# Altium project Sayma_RTM.PrjPcb (part 8 of 11)

## Sheet RTM_IPMI.SchDoc: Sayma RTM
size 420 x 297 mm; $$Internal___BlkDate: 23:43:25_12-13-18; $$Internal_NAME_PLACEHOLDER: a3sheet; $$Internal_Resolution: 00001mm; $$NotCommonProperty_@NAME: RTM_IPMI; $$NotCommonProperty_@PRINTORDER: 15; $$NotCommonProperty_@SHEET: 1; $$NotCommonProperty_@SHEETTOTAL: 16; CmpIndex: 4; Drawing Author: G.Kasprowicz; Drawing Number: Sayma RTM; Drawing Project: 8 channel SAWG; Drawing Revision: 2.0; SymIndex: 2227; Author: G.Kasprowicz; CompanyName: WUT ISE; DrawnBy: G.Kasprowicz; Organization: WUT ISE; Address1: PW ISE; Address2: Nowowiejska 15/19 00-665 Warsaw; Address3: gkasprow@gmail.com; DocumentNumber: 17; Revision: 1.0; SheetNumber: 17; SheetTotal: 18; ModifiedBy: -; CheckedDate: -; Title2: RTM IPMI; DivGrp: WUT ISE; Designer: G.Kasprowicz; ModifiedDate: -; ProjectName: Sensor Box
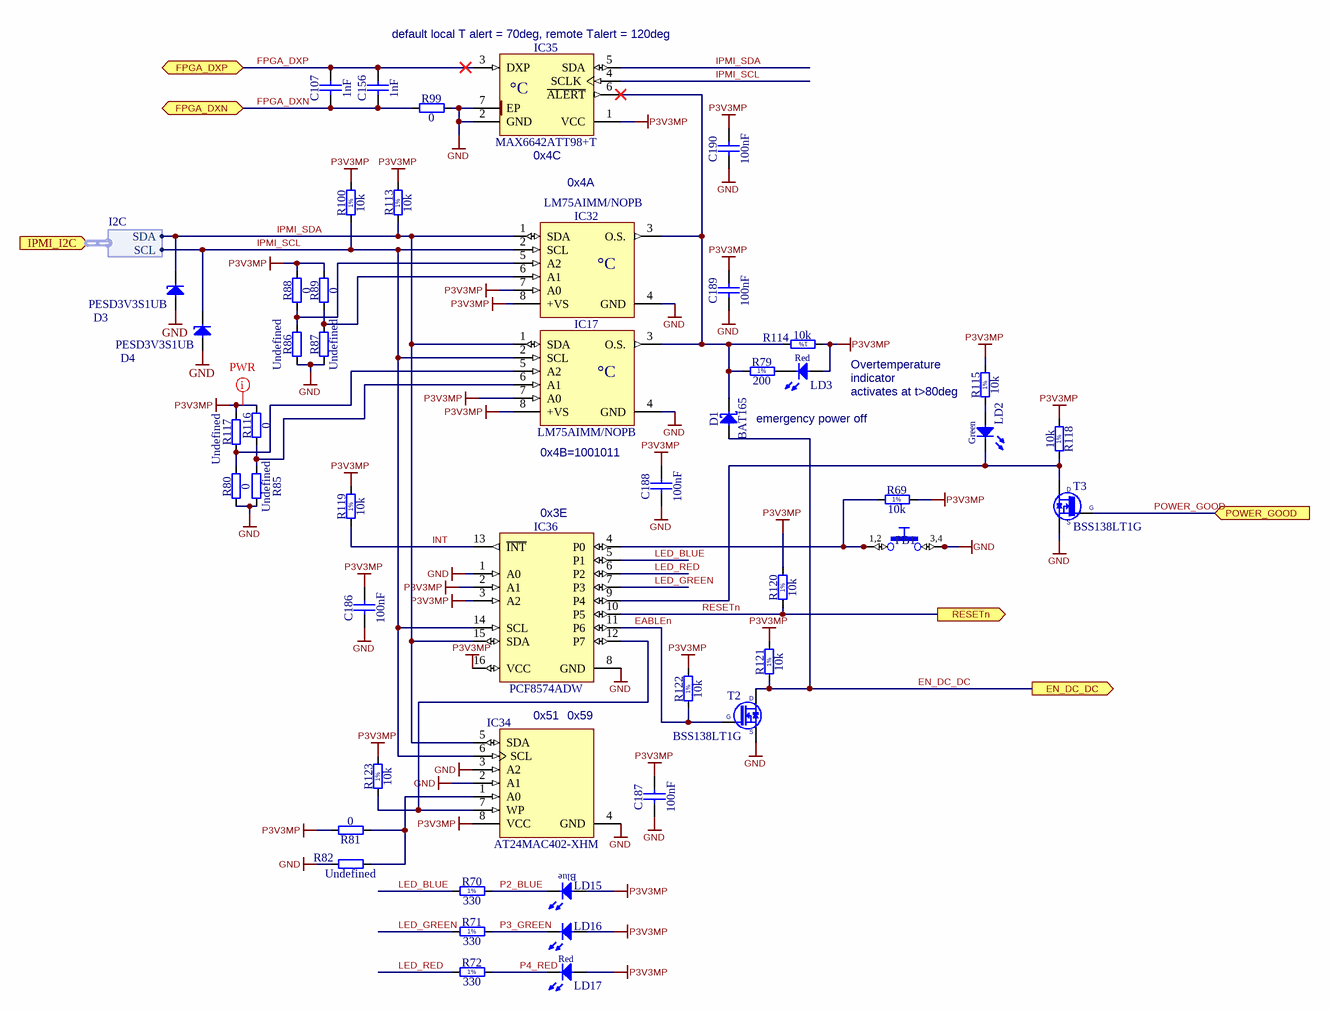
[diagram p11: RTM_IPMI.SchDoc]

### Parts
C107  1nF  [CAPC1005X55N]
C156  1nF  [CAPC1005X55N]
C186  100nF  [CAPC0603X33N]
C187  100nF  [CAPC0603X33N]
C188  100nF  [CAPC0603X33N]
C189  100nF  [CAPC0603X33N]
C190  100nF  [CAPC0603X33N]
D1  BAT165  [SOD2512X110N]
D3  PESD3V3S1UB  [SODFL1608X65N]
D4  PESD3V3S1UB  [SODFL1608X65N]
IC17  LM75AIMM/NOPB  [SOP65P490X109-8N]
IC32  LM75AIMM/NOPB  [SOP65P490X109-8N]
IC34  AT24MAC402-XHM  [SOP65P640X120-8N]
IC35  MAX6642ATT98+T  [SON95P300X300X80-7N-R160X240]
IC36  PCF8574ADW  [SOIC127P1030X265-16N]
LD2  Green  [LED_KINGBRIGHT_KPH-1608CGCK]
LD3  Red  [LED_KINGBRIGHT_KPH-1608SURCK]
LD15  Blue  [LED_AVAGO_HSMR-C120]  (value not drawn)
LD16  Green  [LED_AVAGO_HSME-C120]  (value not drawn)
LD17  Red  [LED_KINGBRIGHT_KPH-1608SURCK]
PB1  Push Button  [SW_C&K_HDT0001]  (value not drawn)
R69  10k  [RESC1005X40N]
R70  330  [RESC1005X40N]
R71  330  [RESC1005X40N]
R72  330  [RESC1005X40N]
R79  200  [RESC1005X40N]
R80  0  [RESC1005X40N]
R81  0  [RESC1005X40N]
R82  Undefined  [RESC1005X40N]
R85  Undefined  [RESC1005X40N]
R86  Undefined  [RESC1005X40N]
R87  Undefined  [RESC1005X40N]
R88  0  [RESC1005X40N]
R89  0  [RESC1005X40N]
R99  0  [RESC1005X40N]
R100  10k  [RESC1005X40N]
R113  10k  [RESC1005X40N]
R114  10k  [RESC1005X40N]
R115  10k  [RESC1005X40N]
R116  0  [RESC1005X40N]
R117  Undefined  [RESC1005X40N]
R118  10k  [RESC1005X40N]
R119  10k  [RESC1005X40N]
R120  10k  [RESC1005X40N]
R121  10k  [RESC1005X40N]
R122  10k  [RESC1005X40N]
R123  10k  [RESC1005X40N]
T2  BSS138LT1G  [SOT95P240X110-3N]
T3  BSS138LT1G  [SOT95P240X110-3N]

### Ports
EN_DC_DC (out), FPGA_DXN (bidir), FPGA_DXP (bidir), IPMI_I2C (in, harness I2C), POWER_GOOD (in), RESETn (out)

### Harnesses
I2C: SCL, SDA

### Nets
GND: C186.1 C187.1 C188.1 C189.1 C190.1 D3.2(A) D4.2(A) IC17.4(GND) IC32.4(GND) IC34.2(A1) IC34.3(A2) IC34.4(GND) IC35.2(GND) IC35.7(EP) IC36.1(A0) IC36.8(GND) PB1.3 PB1.4 R80.1 R82.1 R85.1 R86.1 R87.1 R99.2 T2.2(S) T3.2(S)
P3V3MP: C186.2 C187.2 C188.2 C189.2 C190.2 IC17.7(A0) IC17.8(+VS) IC32.7(A0) IC32.8(+VS) IC34.8(VCC) IC35.1(VCC) IC36.2(A1) IC36.3(A2) IC36.16(VCC) LD3.2(A) LD15.2(A) LD16.2(A) LD17.2(A) R69.2 R81.2 R88.2 R89.2 R100.2 R113.2 R114.1 R115.2 R116.2 R117.2 R118.2 R119.2 R120.2 R121.2 R122.2 R123.2
EABLEn: IC36.11(P6) R122.1 T2.1(G)
EN_DC_DC: D1.2(A) R121.1 T2.3(D) ; port EN_DC_DC  [project net EN]
FPGA_DXN: C107.1 C156.1 R99.1 ; port FPGA_DXN
FPGA_DXP: C107.2 C156.2 IC35.3(DXP) ; port FPGA_DXP
INT: IC36.13(~{INT}) R119.1
IPMI_SCL: D4.1(C) IC17.2(SCL) IC32.2(SCL) IC34.6(SCL) IC35.4(SCLK) IC36.14(SCL) R100.1 ; port IPMI_I2C.SCL  [project net IPMI_I2C.SCL]
IPMI_SDA: D3.1(C) IC17.1(SDA) IC32.1(SDA) IC34.5(SDA) IC35.5(SDA) IC36.15(SDA) R113.1 ; port IPMI_I2C.SDA  [project net IPMI_I2C.SDA]
LED_BLUE: IC36.5(P1) R70.1
LED_GREEN: IC36.7(P3) R71.1
LED_RED: IC36.6(P2) R72.1
P2_BLUE: LD15.1(C) R70.2
P3_GREEN: LD16.1(C) R71.2
P4_RED: LD17.1(C) R72.2
POWER_GOOD: T3.1(G) ; port POWER_GOOD  [project net PGOOD]
RESETn: IC36.10(P5) R120.1 ; port RESETn
NetD1_1: D1.1(C) IC17.3(O.S.) IC32.3(O.S.) IC35.6(~{ALERT}) R79.1 R114.2
NetIC17_5: IC17.5(A2) R80.2 R117.1
NetIC17_6: IC17.6(A1) R85.2 R116.1
NetIC32_5: IC32.5(A2) R86.2 R88.1
NetIC32_6: IC32.6(A1) R87.2 R89.1
NetIC34_1: IC34.1(A0) R81.1 R82.2
NetIC34_7: IC34.7(WP) IC36.12(P7) R123.1
NetIC36_4: IC36.4(P0) PB1.1 PB1.2 R69.1
NetIC36_9: IC36.9(P4) LD2.1(C) R118.1 T3.3(D)
NetLD2_2: LD2.2(A) R115.1
NetLD3_1: LD3.1(C) R79.2

### Layout directives
net class PWR: P3V3MP

### Notes on the sheet
- default local T alert = 70deg, remote Talert = 120deg
- (near IC35) 0x4C
- 0x4A
- Overtemperature
- indicator
- 0x4B=1001011
- emergency power off
- (near R115) activates at t>80deg
- (near IC36) 0x3E
- (near IC34) 0x51
- (near IC34) 0x59
- Project/Equipment
- Document
- Designer
- Drawn by
- Check.by
- Copyright WUT ISE 2018.
  This documentation describes Open Hardware and is licensed under the CERN OHL v.1.1. You may redistribute and modify this documentation under the terms of the CERN OHL v.1.1. (http://ohwr.org/CERNOHL). This documentation is distributed WITHOUT ANY EXPRESS OR IMPLIED WARRANTY, INCLUDING OF MERCHANTABILITY, SATISFACTORY QUALITY AND FITNESS FOR A PARTICULAR PURPOSE. Please see the CERN OHL v.1.1 for applicable conditions.
- Contact
- File
- Last Mod.
- Print Date
- Sheet
- Size
- A3
- of
- Rev
- (in symbol LM75AIMM/NOPB) °C
- (in symbol MAX6642ATT98+T) °C
- (in symbol R0402_10K_1%_0.0625W_100PPM) 1%
- (in symbol R0402_200R_1%_0.0625W_100PPM) 1%
- (in symbol R0402_330R_1%_0.0625W_100PPM) 1%
- (in symbol SW_C&K_HDT0001) 1,2; 3,4

### Library data of the parts
C107 C156 = CC0402_1NF_50V_10%_X7R: Non-polarised capacitor; Manufacturer: GENERIC; Part Description: SMD Multilayer Chip Ceramic Capacitor; Manufacturer1 Part Number: 223858715623; Tolerance: ±10%; Voltage: 50V; TC: X7R; Manufacturer Part Number: CC0402_1NF_50V_10%_X7R; Part Number: CC0402_1NF_50V_10%_X7R; Value: 1nF; Component Kind: Standard; Component Type: Standard; Pin Count: 2; Status: Not Recommended; Case: 0402; Mounted: Yes; Socket: No; SMD: Yes; Sense: No; Manufacturer1 Example: PHYCOMP; Manufacturer1 ComponentHeight: 0.55mm; HelpURL: \\cern.ch\dfs\Applications\Altium\Datasheets\CC0402_X7R_PHYCOMP.pdf; Author: CERN DEM JLC; CreateDate: 03.12.2007; LatestRevisionDate: 03.12.2007
C186-C190 = CC0201_100NF_6.3V_10%_X5R: Non-polarised capacitor; Manufacturer: GENERIC; Manufacturer1 Part Number: 02016D104KAT2A; Part Description: SMD Multilayer Chip Ceramic Capacitor; TC: X5R; Tolerance: ±10%; Voltage: 6.3V; Case: 0201; Manufacturer Part Number: CC0201_100NF_6.3V_10%_X5R; Manufacturer1 Example: AVX; Part Number: CC0201_100NF_6.3V_10%_X5R; Pin Count: 2; SMD: Yes; Status: Not Recommended; Value: 100nF; Component Kind: Standard; Component Type: Standard; Mounted: Yes; Socket: No; Sense: No; Manufacturer1 ComponentHeight: 0.33mm; HelpURL: \\cern.ch\dfs\Applications\Altium\Datasheets\CC0201_X5R_AVX.pdf; Author: CERN DEM JLC; CreateDate: 03.12.2007; LatestRevisionDate: 03.12.2007
D1 = BAT165: Schottky Diode; Manufacturer: INFINEON; Part Description: Medium Power AF Schottky Diode; Bonding: No; Power: 750mA; PressFit: No; Voltage: 40V; Case: SOD323; ComponentHeight: 1.1mm; Device: BAT165; Manufacturer Part Number: BAT165; Mounted: Yes; PackageDescription: Small Outline Diode (SOD-323), 1.70mm W X 1.25mm L X 1.10mm H body,  IPC Medium Density; Part Number: BAT165; Pin Count: 2; Sense: No; SMD: Yes; Socket: No; Component Kind: Standard; Component Type: Standard; HelpURL: \\cern.ch\dfs\Applications\Altium\Datasheets\BAT165.pdf; Author: CERN DEM JLC; CreateDate: 12.11.2014; LatestRevisionDate: 12.11.2014
D3 D4 = PESD3V3S1UB: ESD protection diode; Manufacturer: NXP SEMICONDUCTORS; Part Description: ESD protection diode (23kV); Voltage: 3V3; Power: 330W; PressFit: No; Bonding: No; Manufacturer Part Number: PESD3V3S1UB; PackageDescription: Ultra Small Outline Diode Flat Lead (SOD-523), Body; 1.2mm L X 0.8mm W X 0.65mm H, IPC Medium Density; Part Number: PESD3V3S1UB; Component Kind: Standard; Component Type: Standard; Device: PESD3V3S1UB; Pin Count: 2; Case: SOD523; Mounted: Yes; Socket: No; SMD: Yes; Sense: No; ComponentHeight: 0.65mm; HelpURL: \\cern.ch\dfs\Applications\Altium\Datasheets\PESD3V3S1UB.pdf; Author: CERN DEM JLC; CreateDate: 29.11.2012; LatestRevisionDate: 29.11.2012
IC17 IC32 = LM75AIMM/NOPB: Digital Temperature Sensor and Thermal Watchdog with Two-Wire Interface; Manufacturer: TEXAS INSTRUMENTS; Part Description: -25° to +100°C ±2°C Digital Temperature Sensor and Thermal Watchdog with Two-Wire Interface; Bonding: No; PressFit: No; Case: SSOP8; ComponentHeight: 1.09mm; Device: LM75AIMM/NOPB; Manufacturer Part Number: LM75AIMM/NOPB; Mounted: Yes; PackageDescription: SOP, 0.65mm pitch; 8 pin,3.00mm W X 3.00mm L X 1.09mm H bodyI, PC Medium Density; Part Number: LM75AIMM/NOPB; Pin Count: 8; Sense: No; SMD: Yes; Socket: No; Component Kind: Standard; Component Type: Standard; HelpURL: \\cern.ch\dfs\Applications\Altium\Datasheets\LM75AIMM-NOPB.pdf; Author: CERN DEM JLC; CreateDate: 15.10.2012; LatestRevisionDate: 15.10.2012
IC34 = AT24MAC402-XHM: 1.7V to 5.5V, I2C-Compatible (2-wire) 2-Kbit (256 x 8) Serial EEPROM; Manufacturer: ATMEL; Part Description: 1.7V to 5.5V, I2C-Compatible (2-wire) 2-Kbit (256 x 8) Serial EEPROM with a EUI-48 Address; Bonding: No; PressFit: No; Author: CERN DEM MR; Case: TSSOP8; Component Kind: Standard; Component Type: Standard; ComponentHeight: 1.2mm; CreateDate: 09.03.2016; Device: AT24MAC402-XHM; Footprint: SOP65X640X120-8N; HelpURL: \\cern.ch\dfs\Applications\Altium\Datasheets\AT24MAC402-XHM.pdf; LatestRevisionDate: 09.11.2016; Manufacturer Part Number: AT24MAC402-XHM; Mounted: Yes; PackageDescription: SOP, 0.65mm pitch; 8 pin, 4.40mm W X 3.00mm L X 1.20mm H body, IPC Medium Density; Part Number: AT24MAC402-XHM; Pin Count: 8; Sense: No; SMD: Yes; Socket: No
IC35 = MAX6642ATT98+T: ±1°C, SMBus-Compatible Remote/Local Temperature Sensor with Overtemperature Alarm; Manufacturer: MAXIM; Part Description: 0°C to +125°C, ±1°C, SMBus-Compatible Remote/Local Temperature Sensor with Overtemperature Alarm (Address 1001 100); Bonding: No; PressFit: No; Case: SON6; ComponentHeight: 0.8mm; Device: MAX6642ATT98+T; Manufacturer Part Number: MAX6642ATT98+T; Mounted: Yes; PackageDescription: SON, 0.95mm Pitch; 6 Pin, 3.00mm W X 3mm L X 0.80mm H body (w/Thermal Tab 1.6mm x 2.4mm); Part Number: MAX6642ATT98+T; Pin Count: 7; Sense: No; SMD: Yes; Socket: No; Component Kind: Standard; Component Type: Standard; HelpURL: \\cern.ch\dfs\Applications\Altium\Datasheets\MAX6642ATT98+T.pdf; Author: CERN DEM JLC; CreateDate: 26.11.2013; LatestRevisionDate: 26.11.2013
IC36 = PCF8574ADW: Remote 8-bit I/O Expander For I2C Bus; Manufacturer: TEXAS INSTRUMENTS; Bonding: No; PressFit: No; Case: SOIC16W; ComponentHeight: 2.65mm; Device: PCF8574ADW; Manufacturer Part Number: PCF8574ADW; Mounted: Yes; PackageDescription: SOIC 16, Pitch 1.27mm - Body 7.5x10.3mm, IPC Medium Density; Part Description: Remote 8-bit I/O Expander For I2C Bus; Part Number: PCF8574ADW; Pin Count: 16; Sense: No; SMD: Yes; Socket: No; Component Kind: Standard; Component Type: Standard; Author: CERN DEM JLC; HelpURL: \\cern.ch\dfs\Applications\Altium\Datasheets\PCF8574ADW.pdf; CreateDate: 01.11.2012; LatestRevisionDate: 01.11.2012
LD2 = LED_KINGBRIGHT_KPH-1608CGCK: LED Green 1C 2A; Part Description: SMD Green LED, Case 1.6mmX0.8mm(0603), 0.65mm Thickness; Bonding: No; PressFit: No; Author: CERN DEM JLC; Color: Green; Component Kind: Standard; Component Type: Standard; ComponentHeight: 0.65mm; CreateDate: 03.07.2017; HelpURL: \\cern.ch\dfs\Applications\Altium\Datasheets\LED_KINGBRIGHT_KPH-1608CGCK.pdf; LatestRevisionDate: 03.07.2017; Manufacturer Part Number: KPH-1608CGCK; Manufacturer: KINGBRIGHT; Mounted: Yes; PackageDescription: SMT Green LED, Case 0603, Body L 1.6 x W 0.8mm H 0.65mm; Part Number: LED_KINGBRIGHT_KPH-1608CGCK; Pin Count: 2; Sense: No; SMD: Yes; Socket: No
LD3 = LED_KINGBRIGHT_KPH-1608SURCK: LED Red 1C 2A; Part Description: SMD Hyper Red LED, Case 1.6mmX0.8mm(0603), 0.65mm Thickness; Bonding: No; PressFit: No; Author: CERN DEM JLC; Color: Red; Component Kind: Standard; Component Type: Standard; ComponentHeight: 0.65mm; CreateDate: 03.07.2017; HelpURL: \\cern.ch\dfs\Applications\Altium\Datasheets\LED_KINGBRIGHT_KPH-1608SURCK.pdf; LatestRevisionDate: 03.07.2017; Manufacturer Part Number: KPH-1608SURCK; Manufacturer: KINGBRIGHT; Mounted: Yes; PackageDescription: SMT Hyper Red LED, Case 0603, Body L 1.6 x W 0.8mm H 0.65mm; Part Number: LED_KINGBRIGHT_KPH-1608SURCK; Pin Count: 2; Sense: No; SMD: Yes; Socket: No
LD15 = LED_AVAGO_HSMR-C120: LED Blue 1C 2A; Manufacturer: AVAGO TECHNOLOGIES; Part Description: High Performance Right Angle Chip InGaN Blue LED; Bonding: No; PressFit: No; Author: CERN DEM JLC; Color: Blue; Component Kind: Standard; Component Type: Standard; ComponentHeight: 0.7mm; CreateDate: 07.07.2014; HelpURL: \\cern.ch\dfs\Applications\Altium\Datasheets\LED_AVAGO_HSMR-C120.pdf; LatestRevisionDate: 07.07.2014; Manufacturer Part Number: HSMR-C120; Mounted: Yes; PackageDescription: Blue Chip LED, 2-Leads, Body 1.7x1.1mm, Side Emitting Package; Part Number: LED_AVAGO_HSMR-C120; Pin Count: 2; Sense: No; SMD: Yes; Socket: No
LD16 = LED_AVAGO_HSME-C120: LED Green 1C 2A; Manufacturer: AVAGO TECHNOLOGIES; Part Description: High Performance Right Angle Chip Green LED; Bonding: No; PressFit: No; Author: CERN DEM JMW; Color: Green; Component Kind: Standard; Component Type: Standard; ComponentHeight: 0.7mm; CreateDate: 22.07.2009; HelpURL: \\cern.ch\dfs\Applications\Altium\Datasheets\LED_AVAGO_HSME-C120.pdf; LatestRevisionDate: 20.06.2012; Manufacturer Part Number: HSME-C120; Mounted: Yes; PackageDescription: Green Chip LED, 2-Leads, Body 1.7x1.1mm, Side Emitting Package; Part Number: LED_AVAGO_HSME-C120; Pin Count: 2; Sense: No; SMD: Yes; Socket: No; ComponentLink1URL: \\cern.ch\dfs\Applications\Altium\Datasheets\LED_AVAGO_HSME-C110_DESIGN-GUIDE.pdf; ComponentLink1Description: Design Guide
LD17 = LED_KINGBRIGHT_KPH-1608SURCK: LED Red 1C 2A; Part Description: SMD Hyper Red LED, Case 1.6mmX0.8mm(0603), 0.65mm Thickness; PressFit: No; Bonding: No; Part Number: LED_KINGBRIGHT_KPH-1608SURCK; Component Kind: Standard; Component Type: Standard; Color: Red; PackageDescription: SMT Hyper Red LED, Case 0603, Body L 1.6 x W 0.8mm H 0.65mm; Manufacturer: KINGBRIGHT; Manufacturer Part Number: KPH-1608SURCK; Pin Count: 2; Mounted: Yes; Socket: No; SMD: Yes; Sense: No; ComponentHeight: 0.65mm; HelpURL: \\cern.ch\dfs\Applications\Altium\Datasheets\LED_KINGBRIGHT_KPH-1608SURCK.pdf; Author: CERN DEM JLC; CreateDate: 03.07.2017; LatestRevisionDate: 03.07.2017
PB1 = SW_C&K_HDT0001: Push-Button Switch SPDT; Manufacturer: C&K; Part Description: 5VDC 1mA SPST-NO Micro Mini Surface Surface Mount Detect Push-Button Switch, HDT Series; PressFit: No; Author: CERN DEM JLC; Component Kind: Standard; Component Type: Standard; ComponentHeight: 3.35mm; CreateDate: 15.08.2012; Family: Push Button; HelpURL: \\cern.ch\dfs\Applications\Altium\Datasheets\SW_C&K_HDT0001.pdf; LatestRevisionDate: 15.08.2012; Manufacturer Part Number: HDT0001; Mounted: Yes; PackageDescription: Body 3.5x2.8mm, Micro Mini Surface Mount Detect Switches, HDT Serie; Part Number: SW_C&K_HDT0001; Pin Count: 4; Sense: No; SMD: Yes; Socket: No; Status: None
R69 R100 R113-R115 R118-R123 = R0402_10K_1%_0.0625W_100PPM: Resistor - 1%; Manufacturer: GENERIC; Manufacturer1 Part Number: 232270671003L; Part Description: General Purpose Thick Film Chip Resistor; TC: ±100ppm/°C; PressFit: No; Case: 0402; Manufacturer Part Number: R0402_10K_1%_0.0625W_100PPM; Manufacturer1 ComponentHeight: 0.4mm; Manufacturer1 Example: YAGEO PHYCOMP; Part Number: R0402_10K_1%_0.0625W_100PPM; Pin Count: 2; Power: 0.0625W; Sense: No; SMD: Yes; Status: Not Recommended; Tolerance: ±1%; Value: 10k; Component Kind: Standard; Component Type: Standard; Mounted: Yes; Socket: No; HelpURL: \\cern.ch\dfs\Applications\Altium\Datasheets\R0402_Phycomp_RC0402.pdf; Author: CERN DEM JLC; CreateDate: 03.12.2007; LatestRevisionDate: 17.10.2012
R70-R72 = R0402_330R_1%_0.0625W_100PPM: Resistor - 1%; Manufacturer: GENERIC; Manufacturer1 Part Number: 232270673301L; Part Description: General Purpose Thick Film Chip Resistor; TC: ±100ppm/°C; PressFit: No; Case: 0402; Manufacturer Part Number: R0402_330R_1%_0.0625W_100PPM; Manufacturer1 ComponentHeight: 0.4mm; Manufacturer1 Example: YAGEO PHYCOMP; Part Number: R0402_330R_1%_0.0625W_100PPM; Pin Count: 2; Power: 0.0625W; Sense: No; SMD: Yes; Status: Not Recommended; Tolerance: ±1%; Value: 330; Component Kind: Standard; Component Type: Standard; Mounted: Yes; Socket: No; HelpURL: \\cern.ch\dfs\Applications\Altium\Datasheets\R0402_Phycomp_RC0402.pdf; Author: CERN DEM JLC; CreateDate: 03.12.2007; LatestRevisionDate: 17.10.2012
R79 = R0402_200R_1%_0.0625W_100PPM: Resistor - 1%; Manufacturer: GENERIC; Manufacturer1 Part Number: 232270672001L; Part Description: General Purpose Thick Film Chip Resistor; TC: ±100ppm/°C; PressFit: No; Case: 0402; Manufacturer Part Number: R0402_200R_1%_0.0625W_100PPM; Manufacturer1 ComponentHeight: 0.4mm; Manufacturer1 Example: YAGEO PHYCOMP; Part Number: R0402_200R_1%_0.0625W_100PPM; Pin Count: 2; Power: 0.0625W; Sense: No; SMD: Yes; Status: Not Recommended; Tolerance: ±1%; Value: 200; Component Kind: Standard; Component Type: Standard; Mounted: Yes; Socket: No; HelpURL: \\cern.ch\dfs\Applications\Altium\Datasheets\R0402_Phycomp_RC0402.pdf; Author: CERN DEM JLC; CreateDate: 03.12.2007; LatestRevisionDate: 17.10.2012
R80 R81 R88 R89 R99 R116 = R0402_0R_JUMPER: Resistor; Manufacturer: GENERIC; Manufacturer1 Part Number: 232270591001L; Part Description: 1A (0.05R Max DC Resistance) Zero Ohm Jumper; PressFit: No; Case: 0402; Manufacturer Part Number: R0402_0R_JUMPER; Manufacturer1 ComponentHeight: 0.4mm; Manufacturer1 Example: YAGEO PHYCOMP; Part Number: R0402_0R_JUMPER; Pin Count: 2; Sense: No; SMD: Yes; Status: Not Recommended; Value: 0; Component Kind: Standard; Component Type: Standard; Mounted: Yes; Socket: No; HelpURL: \\cern.ch\dfs\Applications\Altium\Datasheets\R0402_Phycomp_RC0402.pdf; Author: CERN DEM JLC; CreateDate: 03.12.2007; LatestRevisionDate: 17.10.2012
R82 R85-R87 R117 = R0402_NO-VALUE: Resistor; Part Description: Reserved Footprint For a 0402 (1005) Chip Resistor; PressFit: No; Mounted: No; Case: 0402; Manufacturer Part Number: R0402_NO-VALUE; Manufacturer: Undefined; Manufacturer1 ComponentHeight: Undefined; Manufacturer1 Example: Undefined; Manufacturer1 Part Number: Undefined; Part Number: R0402_NO-VALUE; Pin Count: 2; Sense: No; SMD: Yes; Status: None; Value: Undefined; Component Kind: Standard; Component Type: Standard; Socket: No; HelpURL: Undefined; Author: CERN DEM JLC; CreateDate: 03.12.2007; LatestRevisionDate: 13.03.2008
T2 T3 = BSS138LT1G: N-CHANNEL MOSFET WITH DIODE; Manufacturer: ON SEMICONDUCTOR; Part Description: 50V 200mA N-Channel Enhancement Mode Field-Effect Transistor; Bonding: No; PressFit: No; Case: SOT23-3; ComponentHeight: 1.11mm; Device: BSS138LT1G; Manufacturer Part Number: BSS138LT1G; Mounted: Yes; PackageDescription: SOT23 3-Leads, Pitch 0.95mm - Body 1.4x3mm, IPC Medium Density; Part Number: BSS138LT1G; Pin Count: 3; Sense: No; SMD: Yes; Socket: No; Component Kind: Standard; Component Type: Standard; HelpURL: \\cern.ch\dfs\Applications\Altium\Datasheets\BSS138LT1G.pdf; Author: CERN DEM JLC; CreateDate: 23.03.2009; LatestRevisionDate: 23.03.2009

## Sheet DAC_AFE_Mezzanine.SchDoc: Sayma RTM
size 420 x 297 mm; $$Internal___BlkDate: 23:43:25_12-13-18; $$Internal_NAME_PLACEHOLDER: a3sheet; $$Internal_Resolution: 00001mm; $$NotCommonProperty_@NAME: DAC_AFE_Mezzanine; $$NotCommonProperty_@PRINTORDER: 13; $$NotCommonProperty_@SHEET: 1; $$NotCommonProperty_@SHEETTOTAL: 16; $$NotCommonProperty_FORWARD_PCB: 0; CmpIndex: 91; Drawing Author: G.Kasprowicz; Drawing Number: Sayma RTM; Drawing Project: 8 channel SAWG; Drawing Revision: 2.0; SymIndex: 2227; Author: G.Kasprowicz; CompanyName: WUT ISE; DrawnBy: G.Kasprowicz; Organization: WUT ISE; Address1: PW ISE; Address2: Nowowiejska 15/19 00-665 Warsaw; Address3: gkasprow@gmail.com; DocumentNumber: 7; Revision: 1.0; SheetNumber: 7; SheetTotal: 18; ModifiedBy: -; CheckedDate: -; Title2: AFE mezzanine; DivGrp: WUT ISE; Designer: G.Kasprowicz; ModifiedDate: -; ProjectName: Sensor Box
Used 2 times, as channels DAC_AFE_Mezzanine0, DAC_AFE_Mezzanine1. Parts and nets are listed once, with the designators drawn on the sheet.
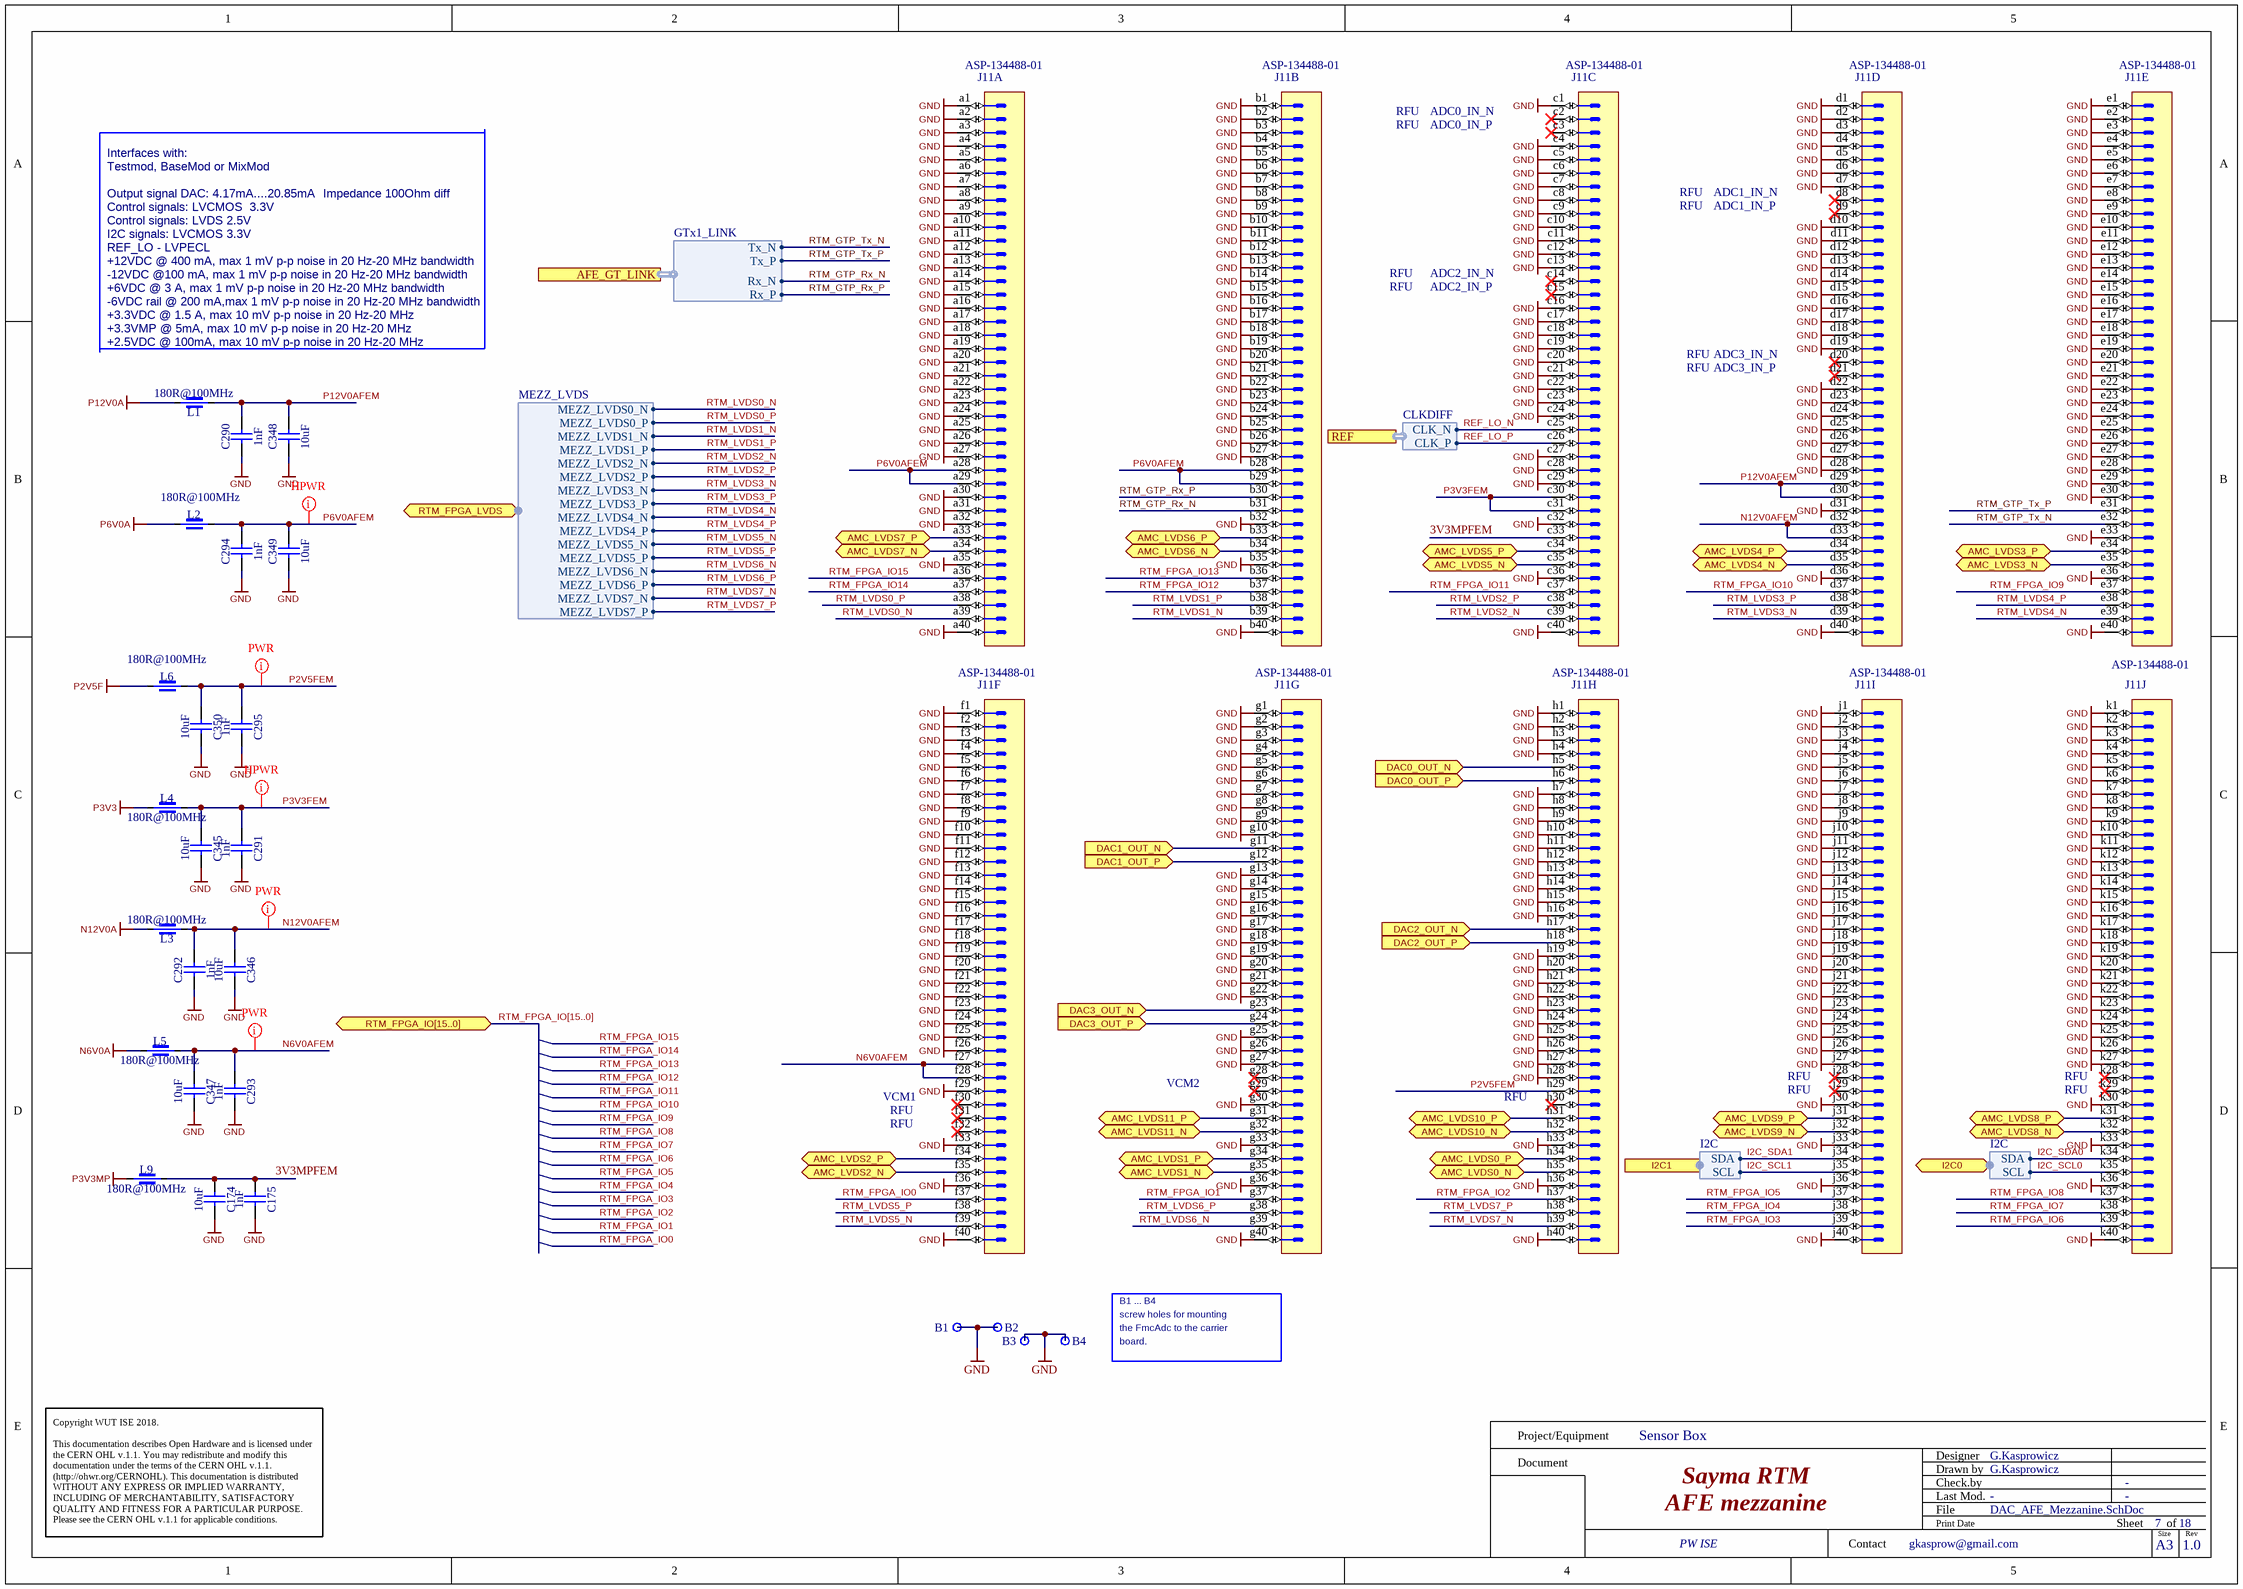
[diagram p12: DAC_AFE_Mezzanine.SchDoc]

### Parts
B1  Plated Hole  [MTG270_500]  (value not drawn)
B2  Plated Hole  [MTG270_500]  (value not drawn)
B3  Plated Hole  [MTG270_500]  (value not drawn)
B4  Plated Hole  [MTG270_500]  (value not drawn)
C174  10uF  [CAPC3216X180N]
C175  1nF  [CAPC1608X90N]
C290  1nF  [CAPC1608X90N]
C291  1nF  [CAPC1608X90N]
C292  1nF  [CAPC1608X90N]
C293  1nF  [CAPC1608X90N]
C294  1nF  [CAPC1608X90N]
C295  1nF  [CAPC1608X90N]
C345  10uF  [CAPC3216X180N]
C346  10uF  [CAPC3216X180N]
C347  10uF  [CAPC3216X180N]
C348  10uF  [CAPC3216X180N]
C349  10uF  [CAPC3216X180N]
C350  10uF  [CAPC3216X180N]
J11  Manufacturer Part Number: ASP-134488-01  [SAMTEC_ASP-134488-01]  (hidden comment: VITA 57)  (parts A,B,C,D,E,F,G,H,I,J of 10)
L1  180R@100MHz  [INDC4516X180N]
L2  180R@100MHz  [INDC4516X180N]
L3  180R@100MHz  [INDC4516X180N]
L4  180R@100MHz  [INDC4516X180N]
L5  180R@100MHz  [INDC4516X180N]
L6  180R@100MHz  [INDC4516X180N]
L9  180R@100MHz  [INDC4516X180N]

### Ports
AFE_GT_LINK (harness GTx1_LINK), AMC_LVDS0_N (bidir), AMC_LVDS0_P (bidir), AMC_LVDS1_N (bidir), AMC_LVDS1_P (bidir), AMC_LVDS2_N (bidir), AMC_LVDS2_P (bidir), AMC_LVDS3_N (bidir), AMC_LVDS3_P (bidir), AMC_LVDS4_N (bidir), AMC_LVDS4_P (bidir), AMC_LVDS5_N (bidir), AMC_LVDS5_P (bidir), AMC_LVDS6_N (bidir), AMC_LVDS6_P (bidir), AMC_LVDS7_N (bidir), AMC_LVDS7_P (bidir), AMC_LVDS8_N (bidir), AMC_LVDS8_P (bidir), AMC_LVDS9_N (bidir), AMC_LVDS9_P (bidir), AMC_LVDS10_N (bidir), AMC_LVDS10_P (bidir), AMC_LVDS11_N (bidir), AMC_LVDS11_P (bidir), DAC0_OUT_N (in), DAC0_OUT_P (in), DAC1_OUT_N (in), DAC1_OUT_P (in), DAC2_OUT_N (in), DAC2_OUT_P (in), DAC3_OUT_N (in), DAC3_OUT_P (in), I2C0 (bidir, harness I2C), I2C1 (harness I2C), REF (harness CLKDIFF), RTM_FPGA_IO[15..0] (bidir), RTM_FPGA_LVDS (bidir, harness MEZZ_LVDS)

### Harnesses
MEZZ_LVDS: MEZZ_LVDS0_N, MEZZ_LVDS0_P, MEZZ_LVDS1_N, MEZZ_LVDS1_P, MEZZ_LVDS2_N, MEZZ_LVDS2_P, MEZZ_LVDS3_N, MEZZ_LVDS3_P, MEZZ_LVDS4_N, MEZZ_LVDS4_P, MEZZ_LVDS5_N, MEZZ_LVDS5_P, MEZZ_LVDS6_N, MEZZ_LVDS6_P, MEZZ_LVDS7_N, MEZZ_LVDS7_P
I2C: SCL, SDA
CLKDIFF: CLK_N, CLK_P
GTx1_LINK: Rx_P, Rx_N, Tx_P, Tx_N

### Nets
GND: B1.1 B2.1 B3.1 B4.1 C174.1 C175.1 C290.2 C291.1 C292.1 C293.1 C294.1 C295.1 C345.1 C346.2 C347.1 C348.2 C349.1 C350.1 J11.a1 J11.a2 J11.a3 J11.a4 J11.a5 J11.a6 J11.a7 J11.a8 J11.a9 J11.a10 J11.a11 J11.a12 J11.a13 J11.a14 J11.a15 J11.a16 J11.a17 J11.a18 J11.a19 J11.a20 J11.a21 J11.a22 J11.a23 J11.a24 J11.a25 J11.a26 J11.a27 J11.a30 J11.a31 J11.a32 J11.a35 J11.a40 J11.b1 J11.b2 J11.b3 J11.b4 J11.b5 J11.b6 J11.b7 J11.b8 J11.b9 J11.b10 J11.b11 J11.b12 J11.b13 J11.b14 J11.b15 J11.b16 J11.b17 J11.b18 J11.b19 J11.b20 J11.b21 J11.b22 J11.b23 J11.b24 J11.b25 J11.b26 J11.b27 J11.b32 J11.b35 J11.b40 J11.c1 J11.c4 J11.c5 J11.c6 J11.c7 J11.c8 J11.c9 J11.c10 J11.c11 J11.c12 J11.c13 J11.c16 J11.c17 J11.c18 J11.c19 J11.c20 J11.c21 J11.c22 J11.c23 J11.c24 J11.c27 J11.c28 J11.c29 J11.c32 J11.c36 J11.c40 J11.d1 J11.d2 J11.d3 J11.d4 J11.d5 J11.d6 J11.d7 J11.d10 J11.d11 J11.d12 J11.d13 J11.d14 J11.d15 J11.d16 J11.d17 J11.d18 J11.d19 J11.d22 J11.d23 J11.d24 J11.d25 J11.d26 J11.d27 J11.d28 J11.d31 J11.d36 J11.d40 J11.e1 J11.e2 J11.e3 J11.e4 J11.e5 J11.e6 J11.e7 J11.e8 J11.e9 J11.e10 J11.e11 J11.e12 J11.e13 J11.e14 J11.e15 J11.e16 J11.e17 J11.e18 J11.e19 J11.e20 J11.e21 J11.e22 J11.e23 J11.e24 J11.e25 J11.e26 J11.e27 J11.e28 J11.e29 J11.e30 J11.e33 J11.e36 J11.e40 J11.f1 J11.f2 J11.f3 J11.f4 J11.f5 J11.f6 J11.f7 J11.f8 J11.f9 J11.f10 J11.f11 J11.f12 J11.f13 J11.f14 J11.f15 J11.f16 J11.f17 J11.f18 J11.f19 J11.f20 J11.f21 J11.f22 J11.f23 J11.f24 J11.f25 J11.f26 J11.f29 J11.f33 J11.f36 J11.f40 J11.g1 J11.g2 J11.g3 J11.g4 J11.g5 J11.g6 J11.g7 J11.g8 J11.g9 J11.g10 J11.g13 J11.g14 J11.g15 J11.g16 J11.g17 J11.g18 J11.g19 J11.g20 J11.g21 J11.g22 J11.g25 J11.g26 J11.g27 J11.g30 J11.g33 J11.g36 J11.g40 J11.h1 J11.h2 J11.h3 J11.h4 J11.h7 J11.h8 J11.h9 J11.h10 J11.h11 J11.h12 J11.h13 J11.h14 J11.h15 J11.h16 J11.h19 J11.h20 J11.h21 J11.h22 J11.h23 J11.h24 J11.h25 J11.h26 J11.h27 J11.h28 J11.h33 J11.h36 J11.h40 J11.j1 J11.j2 J11.j3 J11.j4 J11.j5 J11.j6 J11.j7 J11.j8 J11.j9 J11.j10 J11.j11 J11.j12 J11.j13 J11.j14 J11.j15 J11.j16 J11.j17 J11.j18 J11.j19 J11.j20 J11.j21 J11.j22 J11.j23 J11.j24 J11.j25 J11.j26 J11.j27 J11.j30 J11.j33 J11.j36 J11.j40 J11.k1 J11.k2 J11.k3 J11.k4 J11.k5 J11.k6 J11.k7 J11.k8 J11.k9 J11.k10 J11.k11 J11.k12 J11.k13 J11.k14 J11.k15 J11.k16 J11.k17 J11.k18 J11.k19 J11.k20 J11.k21 J11.k22 J11.k23 J11.k24 J11.k25 J11.k26 J11.k27 J11.k30 J11.k33 J11.k36 J11.k40
N6V0A: L5.2
N12V0A: L3.2
P2V5F: L6.2
P3V3: L4.2
P3V3MP: L9.2
P6V0A: L2.1
P12V0A: L1.1
3V3MPFEM: C174.2 C175.2 J11.c33 L9.1
AMC_LVDS0_N: J11.h35 ; port AMC_LVDS0_N
AMC_LVDS0_P: J11.h34 ; port AMC_LVDS0_P
AMC_LVDS1_N: J11.g35 ; port AMC_LVDS1_N
AMC_LVDS1_P: J11.g34 ; port AMC_LVDS1_P
AMC_LVDS2_N: J11.f35 ; port AMC_LVDS2_N
AMC_LVDS2_P: J11.f34 ; port AMC_LVDS2_P
AMC_LVDS3_N: J11.e35 ; port AMC_LVDS3_N
AMC_LVDS3_P: J11.e34 ; port AMC_LVDS3_P
AMC_LVDS4_N: J11.d35 ; port AMC_LVDS4_N
AMC_LVDS4_P: J11.d34 ; port AMC_LVDS4_P
AMC_LVDS5_N: J11.c35 ; port AMC_LVDS5_N
AMC_LVDS5_P: J11.c34 ; port AMC_LVDS5_P
AMC_LVDS6_N: J11.b34 ; port AMC_LVDS6_N
AMC_LVDS6_P: J11.b33 ; port AMC_LVDS6_P
AMC_LVDS7_N: J11.a34 ; port AMC_LVDS7_N
AMC_LVDS7_P: J11.a33 ; port AMC_LVDS7_P
AMC_LVDS8_N: J11.k32 ; port AMC_LVDS8_N
AMC_LVDS8_P: J11.k31 ; port AMC_LVDS8_P
AMC_LVDS9_N: J11.j32 ; port AMC_LVDS9_N
AMC_LVDS9_P: J11.j31 ; port AMC_LVDS9_P
AMC_LVDS10_N: J11.h32 ; port AMC_LVDS10_N
AMC_LVDS10_P: J11.h31 ; port AMC_LVDS10_P
AMC_LVDS11_N: J11.g32 ; port AMC_LVDS11_N
AMC_LVDS11_P: J11.g31 ; port AMC_LVDS11_P
DAC0_OUT_N: J11.h5 ; port DAC0_OUT_N
DAC0_OUT_P: J11.h6 ; port DAC0_OUT_P
DAC1_OUT_N: J11.g11 ; port DAC1_OUT_N
DAC1_OUT_P: J11.g12 ; port DAC1_OUT_P
DAC2_OUT_N: J11.h17 ; port DAC2_OUT_N
DAC2_OUT_P: J11.h18 ; port DAC2_OUT_P
DAC3_OUT_N: J11.g23 ; port DAC3_OUT_N
DAC3_OUT_P: J11.g24 ; port DAC3_OUT_P
I2C_SCL0: J11.k35 ; port I2C0.SCL
I2C_SCL1: J11.j35 ; port I2C1.SCL
I2C_SDA0: J11.k34 ; port I2C0.SDA
I2C_SDA1: J11.j34 ; port I2C1.SDA
N6V0AFEM: C293.2 C347.2 J11.f27 J11.f28 L5.1
N12V0AFEM: C292.2 C346.1 J11.d32 J11.d33 L3.1
P2V5FEM: C295.2 C350.2 J11.h29 L6.1
P3V3FEM: C291.2 C345.2 J11.c30 J11.c31 L4.1
P6V0AFEM: C294.2 C349.2 J11.a28 J11.a29 J11.b28 J11.b29 L2.2
P12V0AFEM: C290.1 C348.1 J11.d29 J11.d30 L1.2
REF_LO_N: J11.c25 ; port REF.CLK_N
REF_LO_P: J11.c26 ; port REF.CLK_P
RTM_FPGA_IO0: J11.f37
RTM_FPGA_IO1: J11.g37
RTM_FPGA_IO2: J11.h37
RTM_FPGA_IO3: J11.j39
RTM_FPGA_IO4: J11.j38
RTM_FPGA_IO5: J11.j37
RTM_FPGA_IO6: J11.k39
RTM_FPGA_IO7: J11.k38
RTM_FPGA_IO8: J11.k37
RTM_FPGA_IO9: J11.e37
RTM_FPGA_IO10: J11.d37
RTM_FPGA_IO11: J11.c37
RTM_FPGA_IO12: J11.b37
RTM_FPGA_IO13: J11.b36
RTM_FPGA_IO14: J11.a37
RTM_FPGA_IO15: J11.a36
RTM_GTP_Rx_N: J11.b31 ; port AFE_GT_LINK.Rx_N
RTM_GTP_Rx_P: J11.b30 ; port AFE_GT_LINK.Rx_P
RTM_GTP_Tx_N: J11.e32 ; port AFE_GT_LINK.Tx_N
RTM_GTP_Tx_P: J11.e31 ; port AFE_GT_LINK.Tx_P
RTM_LVDS0_N: J11.a39 ; port RTM_FPGA_LVDS.MEZZ_LVDS0_N
RTM_LVDS0_P: J11.a38 ; port RTM_FPGA_LVDS.MEZZ_LVDS0_P
RTM_LVDS1_N: J11.b39 ; port RTM_FPGA_LVDS.MEZZ_LVDS1_N
RTM_LVDS1_P: J11.b38 ; port RTM_FPGA_LVDS.MEZZ_LVDS1_P
RTM_LVDS2_N: J11.c39 ; port RTM_FPGA_LVDS.MEZZ_LVDS2_N
RTM_LVDS2_P: J11.c38 ; port RTM_FPGA_LVDS.MEZZ_LVDS2_P
RTM_LVDS3_N: J11.d39 ; port RTM_FPGA_LVDS.MEZZ_LVDS3_N
RTM_LVDS3_P: J11.d38 ; port RTM_FPGA_LVDS.MEZZ_LVDS3_P
RTM_LVDS4_N: J11.e39 ; port RTM_FPGA_LVDS.MEZZ_LVDS4_N
RTM_LVDS4_P: J11.e38 ; port RTM_FPGA_LVDS.MEZZ_LVDS4_P
RTM_LVDS5_N: J11.f39 ; port RTM_FPGA_LVDS.MEZZ_LVDS5_N
RTM_LVDS5_P: J11.f38 ; port RTM_FPGA_LVDS.MEZZ_LVDS5_P
RTM_LVDS6_N: J11.g39 ; port RTM_FPGA_LVDS.MEZZ_LVDS6_N
RTM_LVDS6_P: J11.g38 ; port RTM_FPGA_LVDS.MEZZ_LVDS6_P
RTM_LVDS7_N: J11.h39 ; port RTM_FPGA_LVDS.MEZZ_LVDS7_N
RTM_LVDS7_P: J11.h38 ; port RTM_FPGA_LVDS.MEZZ_LVDS7_P

Not connected (* = marked no-connect by the designer): J11 c2* c3* c14* c15* d8* d9* d20* d21* f30* f31* f32* g28* g29* h30* j28* j29* k28* k29*

### Channels
DAC_AFE_Mezzanine0: designators end in A; ports AMC_LVDS0_N=AMC_LVDS.LVDS0_CC_N AMC_LVDS0_P=AMC_LVDS.LVDS0_CC_P AMC_LVDS1_N=AMC_LVDS.LVDS10_N AMC_LVDS1_P=AMC_LVDS.LVDS10_P AMC_LVDS2_N=AMC_LVDS.LVDS7_N AMC_LVDS2_P=AMC_LVDS.LVDS7_P AMC_LVDS3_N=AMC_LVDS.LVDS9_N AMC_LVDS3_P=AMC_LVDS.LVDS9_P AMC_LVDS4_N=AMC_LVDS.LVDS8_N AMC_LVDS4_P=AMC_LVDS.LVDS8_P AMC_LVDS5_N=AMC_LVDS.LVDS11_N AMC_LVDS5_P=AMC_LVDS.LVDS11_P AMC_LVDS6_N=AMC_LVDS.LVDS15_N AMC_LVDS6_P=AMC_LVDS.LVDS15_P AMC_LVDS7_N=AMC_LVDS.LVDS16_N AMC_LVDS7_P=AMC_LVDS.LVDS16_P AMC_LVDS8_N=AMC_LVDS.LVDS19_N AMC_LVDS8_P=AMC_LVDS.LVDS19_P AMC_LVDS9_N=AMC_LVDS.LVDS18_P AMC_LVDS9_P=AMC_LVDS.LVDS18_N AMC_LVDS10_N=AMC_LVDS.LVDS14_N AMC_LVDS10_P=AMC_LVDS.LVDS14_P AMC_LVDS11_N=AMC_LVDS.LVDS17_N AMC_LVDS11_P=AMC_LVDS.LVDS17_P DAC0_OUT_N=OUT3_N DAC0_OUT_P=OUT3_P DAC1_OUT_N=OUT2_N DAC1_OUT_P=OUT2_P DAC2_OUT_N=OUT1_N DAC2_OUT_P=OUT1_P DAC3_OUT_N=OUT0_N DAC3_OUT_P=OUT0_P
DAC_AFE_Mezzanine1: designators end in B; ports AMC_LVDS0_N=AMC_LVDS.LVDS1_CC_N AMC_LVDS0_P=AMC_LVDS.LVDS1_CC_P AMC_LVDS1_N=AMC_LVDS.LVDS4_N AMC_LVDS1_P=AMC_LVDS.LVDS4_P AMC_LVDS2_N=AMC_LVDS.LVDS2_N AMC_LVDS2_P=AMC_LVDS.LVDS2_P AMC_LVDS3_N=AMC_LVDS.LVDS6_N AMC_LVDS3_P=AMC_LVDS.LVDS6_P AMC_LVDS4_N=AMC_LVDS.LVDS5_N AMC_LVDS4_P=AMC_LVDS.LVDS5_P AMC_LVDS5_N=AMC_LVDS.LVDS3_N AMC_LVDS5_P=AMC_LVDS.LVDS3_P AMC_LVDS6_N=AMC_LVDS.LVDS12_N AMC_LVDS6_P=AMC_LVDS.LVDS12_P AMC_LVDS7_N=AMC_LVDS.LVDS13_N AMC_LVDS7_P=AMC_LVDS.LVDS13_P AMC_LVDS8_N=AMC_LVDS.LVDS20_N AMC_LVDS8_P=AMC_LVDS.LVDS20_P AMC_LVDS9_N=AMC_LVDS.LVDS22_N AMC_LVDS9_P=AMC_LVDS.LVDS22_P AMC_LVDS10_N=AMC_LVDS.LVDS23_N AMC_LVDS10_P=AMC_LVDS.LVDS23_P AMC_LVDS11_N=AMC_LVDS.LVDS24_N AMC_LVDS11_P=AMC_LVDS.LVDS24_P DAC0_OUT_N=OUT3_N DAC0_OUT_P=OUT3_P DAC1_OUT_N=OUT2_N DAC1_OUT_P=OUT2_P DAC2_OUT_N=OUT1_N DAC2_OUT_P=OUT1_P DAC3_OUT_N=OUT0_N DAC3_OUT_P=OUT0_P

### Buses and harness runs
bus RTM_FPGA_IO[15..0] = port RTM_FPGA_IO[15..0]

### Layout directives
net class HPWR: P3V3FEM_DAC_AFE_Mezzanine0, P6V0AFEM_DAC_AFE_Mezzanine0
net class PWR: N6V0AFEM_DAC_AFE_Mezzanine0, N12V0AFEM_DAC_AFE_Mezzanine0, P2V5FEM_DAC_AFE_Mezzanine0

### Notes on the sheet
- RFU
- ADC0_IN_N
- ADC0_IN_P
- Interfaces with:
- Testmod, BaseMod or MixMod
- Output signal DAC: 4.17mA....20.85mA
- Impedance 100Ohm diff
- I2C signals: LVCMOS 3.3V
- REF_LO - LVPECL
- Control signals: LVCMOS  3.3V
- +12VDC @ 400 mA, max 1 mV p-p noise in 20 Hz-20 MHz bandwidth
- Control signals: LVDS 2.5V
- ADC1_IN_N
- ADC1_IN_P
- +6VDC @ 3 A, max 1 mV p-p noise in 20 Hz-20 MHz bandwidth
- +3.3VMP @ 5mA, max 10 mV p-p noise in 20 Hz-20 MHz
- -12VDC @100 mA, max 1 mV p-p noise in 20 Hz-20 MHz bandwidth
- +3.3VDC @ 1.5 A, max 10 mV p-p noise in 20 Hz-20 MHz
- -6VDC rail @ 200 mA,max 1 mV p-p noise in 20 Hz-20 MHz bandwidth
- ADC2_IN_N
- ADC2_IN_P
- +2.5VDC @ 100mA, max 10 mV p-p noise in 20 Hz-20 MHz
- ADC3_IN_N
- ADC3_IN_P
- VCM1
- VCM2
- (near J11) RFU
- board.
- screw holes for mounting
- the FmcAdc to the carrier
- B1 ... B4
- Project/Equipment
- Document
- Designer
- Drawn by
- Check.by
- Copyright WUT ISE 2018.
  This documentation describes Open Hardware and is licensed under the CERN OHL v.1.1. You may redistribute and modify this documentation under the terms of the CERN OHL v.1.1. (http://ohwr.org/CERNOHL). This documentation is distributed WITHOUT ANY EXPRESS OR IMPLIED WARRANTY, INCLUDING OF MERCHANTABILITY, SATISFACTORY QUALITY AND FITNESS FOR A PARTICULAR PURPOSE. Please see the CERN OHL v.1.1 for applicable conditions.
- Contact
- File
- Last Mod.
- Print Date
- Sheet
- Size
- A3
- of
- Rev

### Library data of the parts
B1-B4 = PLATED_HOLE2.7_PAD5.0: Single Terminal Socket; Part Description: Plated Through Hole: Hole Dia.=2.7mm Pad Dia.=5.0mm; Mounted: No; Author: CERN DEM JMW; Component Kind: Standard (No BOM); Component Type: Standard (No BOM); ComponentHeight: 0mm; CreateDate: 27.09.2011; Family: Plated Hole; HelpURL: Undefined; LatestRevisionDate: 27.09.2011; PackageDescription: Plated Through Hole: Hole Dia.=2.7mm Pad Dia.=5.0mm; Part Number: PLATED_HOLE2.7_PAD5.0; Pin Count: 1; Sense: No; SMD: No; Socket: No; Status: None
C174 C345-C350 = CC1206_10uF_25V_10%_X7R: Non-polarised capacitor; Manufacturer: GENERIC; Manufacturer1 Part Number: C1206C106K4RACTU; Part Description: SMD Multilayer Chip Ceramic Capacitor; TC: X7R; Tolerance: ±10%; Voltage: 25V; Case: 1206; Manufacturer Part Number: CC1206_10uF_25V_10%_X7R; Manufacturer1 Example: KEMET; Part Number: CC1206_10UF_25V_10%_X7R; Pin Count: 2; SMD: Yes; Status: Preferred; Value: 10uF; Component Kind: Standard; Component Type: Standard; Mounted: Yes; Socket: No; Sense: No; Manufacturer1 ComponentHeight: 1.8mm; HelpURL: \\cern.ch\dfs\Applications\Altium\Datasheets\CC1206_X7R_KEMET.pdf; Author: CERN DEM JLC; CreateDate: 12.09.2012; LatestRevisionDate: 12.09.2012
C175 C290-C295 = CC0603_1NF_50V_5%_NP0: Non-polarised capacitor; Manufacturer: GENERIC; Manufacturer1 Part Number: CC0603JRNPO9BN102; Part Description: SMD Multilayer Chip Ceramic Capacitor; TC: C0G/NP0; Tolerance: ±5%; Voltage: 50V; Case: 0603; Manufacturer Part Number: CC0603_1NF_50V_5%_NP0; Manufacturer1 Example: YAGEO PHYCOMP; Part Number: CC0603_1NF_50V_5%_NP0; Pin Count: 2; SMD: Yes; Status: Preferred; Value: 1nF; Component Kind: Standard; Component Type: Standard; Mounted: Yes; Socket: No; Sense: No; Manufacturer1 ComponentHeight: 0.9mm; HelpURL: \\cern.ch\dfs\Applications\Altium\Datasheets\CC0805_NP0_PHYCOMP_16VTO50V.pdf; Author: CERN DEM JLC; CreateDate: 22.10.2012; LatestRevisionDate: 22.10.2012
J11 = SAMTEC_ASP-134488-01: Connector VITA 57, 400 Male contacts in 10 row abcdefghj; Manufacturer: SAMTEC; Part Description: 400 contacts (10 rows abcdefghj) Surface Mount Male Connector, VITA 57 (MC-HPC-10); PressFit: No; Author: CERN DEM JLC; Component Kind: Standard; Component Type: Standard; ComponentHeight: 6.1mm; CreateDate: 30.04.2009; Family: VITA 57; HelpURL: \\cern.ch\dfs\Applications\Altium\Datasheets\SAMTEC_ASP-134488-01.pdf; LatestRevisionDate: 17.08.2009; Mounted: Yes; Part Number: SAMTEC_ASP-134488-01; Pin Count: 400; SMD: Yes; Socket: No; Status: None; Sense: No
L1-L6 L9 = IND1806_MURATA_BLM41PG181SN1L: Manufacturer: MURATA; Part Description: SMD EMI Suppression Chip Ferrite Bead (BLM41P Series); Power: 3.5A; Resistance: 0.02R; Case: 1806; ComponentHeight: 1.8mm; Manufacturer Part Number: BLM41PG181SN1L; Part Number: IND1806_MURATA_BLM41PG181SN1L; Pin Count: 2; SMD: Yes; Value: 180R@100MHz; Component Kind: Standard; Component Type: Standard; Status: None; Mounted: Yes; Socket: No; Sense: No; HelpURL: \\cern.ch\dfs\Applications\Altium\Datasheets\IND1806_MURATA_BLM41P.pdf; Author: CERN DEM JLC; CreateDate: 26.06.2012; LatestRevisionDate: 26.06.2012

## Sheet I2C_Switch_temp_sens.SchDoc: Sayma RTM
size 420 x 297 mm; Author: G.Kasprowicz; CompanyName: WUT ISE; DrawnBy: G.Kasprowicz; Organization: WUT ISE; Address1: PW ISE; Address2: Nowowiejska 15/19 00-665 Warsaw; Address3: gkasprow@gmail.com; DocumentNumber: 18; Revision: 1.0; SheetNumber: 18; SheetTotal: 18; ModifiedBy: -; CheckedDate: -; Title2: I2C switches & sensors; DivGrp: WUT ISE; Designer: G.Kasprowicz; ModifiedDate: -; ProjectName: Sensor Box
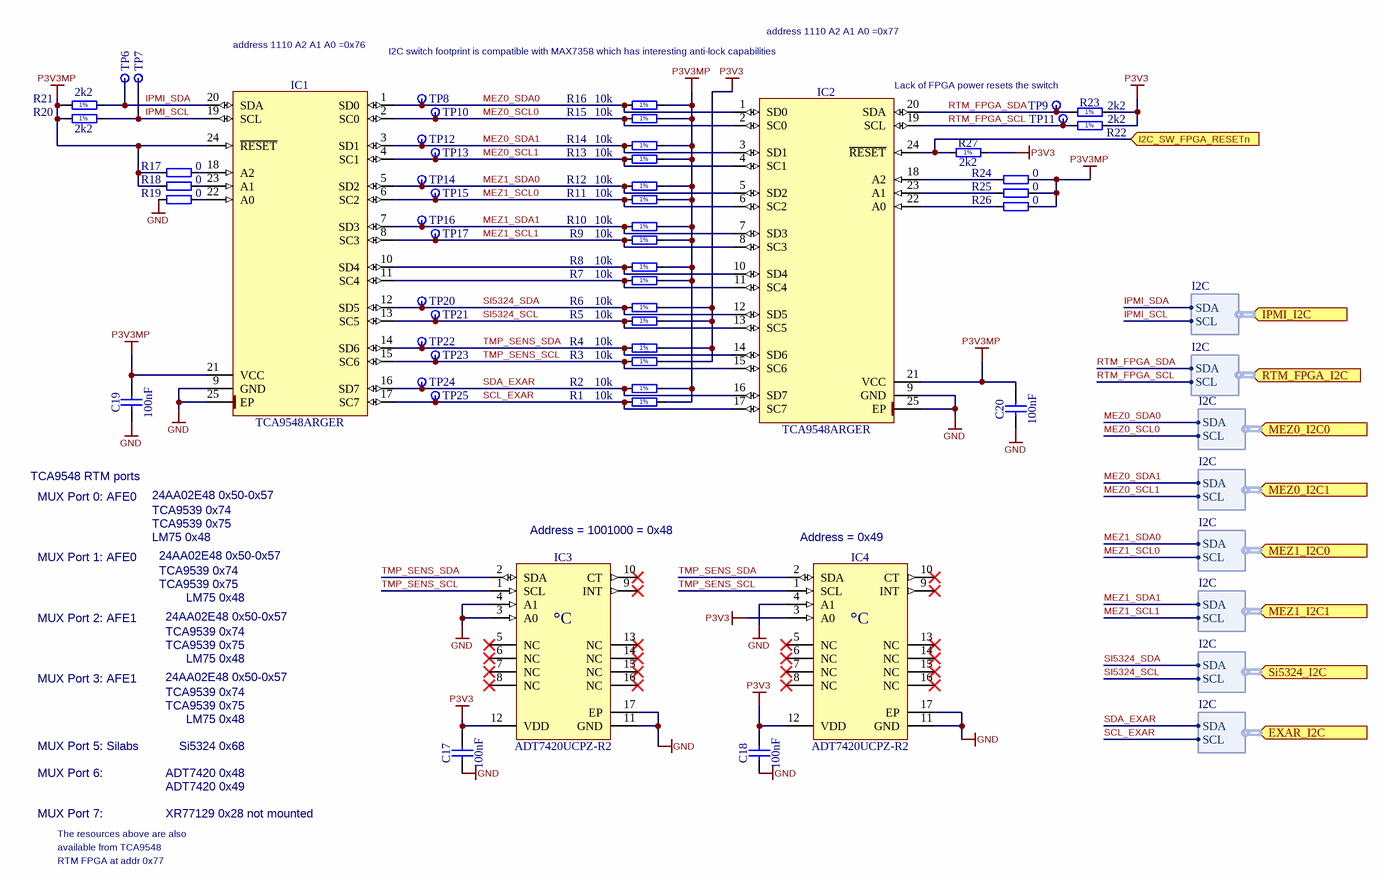
[diagram p13: I2C_Switch_temp_sens.SchDoc]

### Parts
C17  100nF  [CAPC0603X33N]
C18  100nF  [CAPC0603X33N]
C19  100nF  [CAPC0603X33N]
C20  100nF  [CAPC0603X33N]
IC1  TCA9548ARGER  [QFN50P400X400X100-25N-S220]
IC2  TCA9548ARGER  [QFN50P400X400X100-25N-S220]
IC3  ADT7420UCPZ-R2  [QFN65P400X400X80-17N-S270]
IC4  ADT7420UCPZ-R2  [QFN65P400X400X80-17N-S270]
R1  10k  [RESC1005X40N]
R2  10k  [RESC1005X40N]
R3  10k  [RESC1005X40N]
R4  10k  [RESC1005X40N]
R5  10k  [RESC1005X40N]
R6  10k  [RESC1005X40N]
R7  10k  [RESC1005X40N]
R8  10k  [RESC1005X40N]
R9  10k  [RESC1005X40N]
R10  10k  [RESC1005X40N]
R11  10k  [RESC1005X40N]
R12  10k  [RESC1005X40N]
R13  10k  [RESC1005X40N]
R14  10k  [RESC1005X40N]
R15  10k  [RESC1005X40N]
R16  10k  [RESC1005X40N]
R17  0  [RESC1005X40N]
R18  0  [RESC1005X40N]
R19  0  [RESC1005X40N]
R20  2k2  [RESC1005X40N]
R21  2k2  [RESC1005X40N]
R22  2k2  [RESC1005X40N]
R23  2k2  [RESC1005X40N]
R24  0  [RESC1005X40N]
R25  0  [RESC1005X40N]
R26  0  [RESC1005X40N]
R27  2k2  [RESC1005X40N]
TP6  Test Point  [TPS127]  (value not drawn)
TP7  Test Point  [TPS127]  (value not drawn)
TP8  Test Point  [TPS127]  (value not drawn)
TP9  Test Point  [TPS127]  (value not drawn)
TP10  Test Point  [TPS127]  (value not drawn)
TP11  Test Point  [TPS127]  (value not drawn)
TP12  Test Point  [TPS127]  (value not drawn)
TP13  Test Point  [TPS127]  (value not drawn)
TP14  Test Point  [TPS127]  (value not drawn)
TP15  Test Point  [TPS127]  (value not drawn)
TP16  Test Point  [TPS127]  (value not drawn)
TP17  Test Point  [TPS127]  (value not drawn)
TP20  Test Point  [TPS127]  (value not drawn)
TP21  Test Point  [TPS127]  (value not drawn)
TP22  Test Point  [TPS127]  (value not drawn)
TP23  Test Point  [TPS127]  (value not drawn)
TP24  Test Point  [TPS127]  (value not drawn)
TP25  Test Point  [TPS127]  (value not drawn)

### Ports
EXAR_I2C (in, harness I2C), I2C_SW_FPGA_RESETn (in), IPMI_I2C (in, harness I2C), MEZ0_I2C0 (in, harness I2C), MEZ0_I2C1 (in, harness I2C), MEZ1_I2C0 (in, harness I2C), MEZ1_I2C1 (in, harness I2C), RTM_FPGA_I2C (in, harness I2C), Si5324_I2C (in, harness I2C)

### Harnesses
I2C: SDA, SCL

### Nets
GND: C17.1 C18.1 C19.1 C20.1 IC1.9(GND) IC1.25(EP) IC2.9(GND) IC2.25(EP) IC3.3(A0) IC3.4(A1) IC3.11(GND) IC3.17(EP) IC4.4(A1) IC4.11(GND) IC4.17(EP) R19.1
P3V3: C17.2 C18.2 IC3.12(VDD) IC4.3(A0) IC4.12(VDD) R3.2 R4.2 R5.2 R6.2 R22.2 R23.2 R27.2
P3V3MP: C19.2 C20.2 IC1.21(VCC) IC1.24(~{RESET}) IC2.21(VCC) R1.2 R2.2 R7.2 R8.2 R9.2 R10.2 R11.2 R12.2 R13.2 R14.2 R15.2 R16.2 R17.1 R18.1 R20.1 R21.1 R24.2 R25.2 R26.2
I2C_SW_FPGA_RESETn: IC2.24(~{RESET}) R27.1 ; port I2C_SW_FPGA_RESETn
IPMI_SCL: IC1.19(SCL) R20.2 TP7.1 ; port IPMI_I2C.SCL  [project net IPMI_I2C.SCL]
IPMI_SDA: IC1.20(SDA) R21.2 TP6.1 ; port IPMI_I2C.SDA  [project net IPMI_I2C.SDA]
MEZ0_SCL0: IC1.2(SC0) IC2.2(SC0) R15.1 TP10.1 ; port MEZ0_I2C0.SCL  [project net I2C_SCL0]
MEZ0_SCL1: IC1.4(SC1) IC2.4(SC1) R13.1 TP13.1 ; port MEZ0_I2C1.SCL  [project net I2C_SCL1]
MEZ0_SDA0: IC1.1(SD0) IC2.1(SD0) R16.1 TP8.1 ; port MEZ0_I2C0.SDA  [project net I2C_SDA0]
MEZ0_SDA1: IC1.3(SD1) IC2.3(SD1) R14.1 TP12.1 ; port MEZ0_I2C1.SDA  [project net I2C_SDA1]
MEZ1_SCL0: IC1.6(SC2) IC2.6(SC2) R11.1 TP15.1 ; port MEZ1_I2C0.SCL  [project net I2C_SCL0]
MEZ1_SCL1: IC1.8(SC3) IC2.8(SC3) R9.1 TP17.1 ; port MEZ1_I2C1.SCL  [project net I2C_SCL1]
MEZ1_SDA0: IC1.5(SD2) IC2.5(SD2) R12.1 TP14.1 ; port MEZ1_I2C0.SDA  [project net I2C_SDA0]
MEZ1_SDA1: IC1.7(SD3) IC2.7(SD3) R10.1 TP16.1 ; port MEZ1_I2C1.SDA  [project net I2C_SDA1]
RTM_FPGA_SCL: IC2.19(SCL) R22.1 TP11.1 ; port RTM_FPGA_I2C.SCL
RTM_FPGA_SDA: IC2.20(SDA) R23.1 TP9.1 ; port RTM_FPGA_I2C.SDA
SCL_EXAR: IC1.17(SC7) IC2.17(SC7) R1.1 TP25.1 ; port EXAR_I2C.SCL  [project net EXAR_I2C.SCL]
SDA_EXAR: IC1.16(SD7) IC2.16(SD7) R2.1 TP24.1 ; port EXAR_I2C.SDA  [project net EXAR_I2C.SDA]
SI5324_SCL: IC1.13(SC5) IC2.13(SC5) R5.1 TP21.1 ; port Si5324_I2C.SCL  [project net Si5324_I2C.SCL]
SI5324_SDA: IC1.12(SD5) IC2.12(SD5) R6.1 TP20.1 ; port Si5324_I2C.SDA  [project net Si5324_I2C.SDA]
TMP_SENS_SCL: IC1.15(SC6) IC2.15(SC6) IC3.1(SCL) IC4.1(SCL) R3.1 TP23.1
TMP_SENS_SDA: IC1.14(SD6) IC2.14(SD6) IC3.2(SDA) IC4.2(SDA) R4.1 TP22.1
NetIC1_10: IC1.10(SD4) IC2.10(SD4) R8.1
NetIC1_11: IC1.11(SC4) IC2.11(SC4) R7.1
NetIC1_18: IC1.18(A2) R17.2
NetIC1_22: IC1.22(A0) R19.2
NetIC1_23: IC1.23(A1) R18.2
NetIC2_18: IC2.18(A2) R24.1
NetIC2_22: IC2.22(A0) R26.1
NetIC2_23: IC2.23(A1) R25.1

Not connected (* = marked no-connect by the designer): IC3 5(NC)* 6(NC)* 7(NC)* 8(NC)* 9(INT)* 10(CT)* 13(NC)* 14(NC)* 15(NC)* 16(NC)*; IC4 5(NC)* 6(NC)* 7(NC)* 8(NC)* 9(INT)* 10(CT)* 13(NC)* 14(NC)* 15(NC)* 16(NC)*

### Notes on the sheet
- address 1110 A2 A1 A0 =0x76
- I2C switch footprint is compatible with MAX7358 which has interesting anti-lock capabilities
- address 1110 A2 A1 A0 =0x77
- Lack of FPGA power resets the switch
- TCA9548 RTM ports
- MUX Port 0: AFE0
- LM75 0x48
- TCA9539 0x75
- TCA9539 0x74
- 24AA02E48 0x50-0x57
- (near IC3) Address = 1001000 = 0x48
- (near IC4) Address = 0x49
- MUX Port 1: AFE0
- MUX Port 2: AFE1
- MUX Port 5: Silabs
- MUX Port 3: AFE1
- Si5324 0x68
- MUX Port 6:
- ADT7420 0x48
- ADT7420 0x49
- MUX Port 7:
- The resources above are also
- RTM FPGA at addr 0x77
- available from TCA9548
- XR77129 0x28 not mounted
- Project/Equipment
- Document
- Designer
- Drawn by
- Check.by
- Copyright WUT ISE 2018.
  This documentation describes Open Hardware and is licensed under the CERN OHL v.1.1. You may redistribute and modify this documentation under the terms of the CERN OHL v.1.1. (http://ohwr.org/CERNOHL). This documentation is distributed WITHOUT ANY EXPRESS OR IMPLIED WARRANTY, INCLUDING OF MERCHANTABILITY, SATISFACTORY QUALITY AND FITNESS FOR A PARTICULAR PURPOSE. Please see the CERN OHL v.1.1 for applicable conditions.
- Contact
- File
- Last Mod.
- Print Date
- Sheet
- Size
- A3
- of
- Rev
- (in symbol ADT7420UCPZ-R2) °C
- (in symbol R0402_2K2_1%_0.0625W_100PPM) 1%
- (in symbol R0402_10K_1%_0.0625W_100PPM) 1%

### Library data of the parts
C17-C20 = CC0201_100NF_6.3V_10%_X5R: as C186-C190 on sheet RTM_IPMI; Case: 0201; Manufacturer Part Number: CC0201_100NF_6.3V_10%_X5R; Manufacturer1 Example: AVX; Part Number: CC0201_100NF_6.3V_10%_X5R; Pin Count: 2; SMD: Yes; Status: Not Recommended; Value: 100nF; Component Kind: Standard; Component Type: Standard; Mounted: Yes; Socket: No; Sense: No; Manufacturer1 ComponentHeight: 0.33mm; HelpURL: \\cern.ch\dfs\Applications\Altium\Datasheets\CC0201_X5R_AVX.pdf; Author: CERN DEM JLC; CreateDate: 03.12.2007; LatestRevisionDate: 03.12.2007
IC1 IC2 = TCA9548ARGER: Low Voltage 8-Channel I2C Switch With Reset; Manufacturer: TEXAS INSTRUMENTS; Bonding: No; PressFit: No; Case: QFN24; ComponentHeight: 1mm; Device: TCA9548ARGER; Manufacturer Part Number: TCA9548ARGER; Mounted: Yes; PackageDescription: QFN, 0.50mm Pitch, Square; 24 Pin, 4.00mm L X 4.00mm W X 1.00mm H body (w/thermal tab 2.2 X 2.2mm), IPC Medium Density; Part Description: Low Voltage 8-Channel I2C Switch With Reset; Part Number: TCA9548ARGER; Pin Count: 25; Sense: No; SMD: Yes; Socket: No; Component Kind: Standard; Component Type: Standard; Author: CERN DEM JLC; HelpURL: \\cern.ch\dfs\Applications\Altium\Datasheets\TCA9548ARGER.pdf; CreateDate: 07.07.2014; LatestRevisionDate: 07.07.2014
IC3 IC4 = ADT7420UCPZ-R2: ±0.25°C Accurate, 16-Bit Digital I2C Temperature Sensor; Manufacturer: ANALOG DEVICES; Part Description: -20° to +105°C ±0.25°C Accurate, 16-Bit Digital I2C Temperature Sensor; Bonding: No; PressFit: No; Case: QFN16; ComponentHeight: 0.8mm; Device: ADT7420UCPZ-R2; Manufacturer Part Number: ADT7420UCPZ-R2; Mounted: Yes; PackageDescription: QFN, 0.65mm Pitch, Square; 16 Pin, 4.00mm L X 4.00mm W X 0.80mm H Body (w/thermal tab 2.7 X 2.7mm),  IPC Medium Density; Part Number: ADT7420UCPZ-R2; Pin Count: 8; Sense: No; SMD: Yes; Socket: No; Component Kind: Standard; Component Type: Standard; HelpURL: \\cern.ch\dfs\Applications\Altium\Datasheets\ADT7420UCPZ-R2.pdf; Author: CERN DEM JLC; CreateDate: 21.02.2013; LatestRevisionDate: 21.02.2013
R1-R16 = R0402_10K_1%_0.0625W_100PPM: as R69 on sheet RTM_IPMI; Case: 0402; Manufacturer Part Number: R0402_10K_1%_0.0625W_100PPM; Manufacturer1 ComponentHeight: 0.4mm; Manufacturer1 Example: YAGEO PHYCOMP; Part Number: R0402_10K_1%_0.0625W_100PPM; Pin Count: 2; Power: 0.0625W; Sense: No; SMD: Yes; Status: Not Recommended; Tolerance: ±1%; Value: 10k; Component Kind: Standard; Component Type: Standard; Mounted: Yes; Socket: No; HelpURL: \\cern.ch\dfs\Applications\Altium\Datasheets\R0402_Phycomp_RC0402.pdf; Author: CERN DEM JLC; CreateDate: 03.12.2007; LatestRevisionDate: 17.10.2012
R17-R19 R24-R26 = R0402_0R_JUMPER: as R80 on sheet RTM_IPMI; Case: 0402; Manufacturer Part Number: R0402_0R_JUMPER; Manufacturer1 ComponentHeight: 0.4mm; Manufacturer1 Example: YAGEO PHYCOMP; Part Number: R0402_0R_JUMPER; Pin Count: 2; Sense: No; SMD: Yes; Status: Not Recommended; Value: 0; Component Kind: Standard; Component Type: Standard; Mounted: Yes; Socket: No; HelpURL: \\cern.ch\dfs\Applications\Altium\Datasheets\R0402_Phycomp_RC0402.pdf; Author: CERN DEM JLC; CreateDate: 03.12.2007; LatestRevisionDate: 17.10.2012
R20-R23 R27 = R0402_2K2_1%_0.0625W_100PPM: Resistor - 1%; Manufacturer: GENERIC; Manufacturer1 Part Number: 232270672202L; Part Description: General Purpose Thick Film Chip Resistor; TC: ±100ppm/°C; PressFit: No; Case: 0402; Manufacturer Part Number: R0402_2K2_1%_0.0625W_100PPM; Manufacturer1 ComponentHeight: 0.4mm; Manufacturer1 Example: YAGEO PHYCOMP; Part Number: R0402_2K2_1%_0.0625W_100PPM; Pin Count: 2; Power: 0.0625W; Sense: No; SMD: Yes; Status: Not Recommended; Tolerance: ±1%; Value: 2k2; Component Kind: Standard; Component Type: Standard; Mounted: Yes; Socket: No; HelpURL: \\cern.ch\dfs\Applications\Altium\Datasheets\R0402_Phycomp_RC0402.pdf; Author: CERN DEM JLC; CreateDate: 03.12.2007; LatestRevisionDate: 17.10.2012
TP6-TP17 TP20-TP25 = SMD_PAD_1.27X1.27MM: Part Description: 1.27mm x 1.27mm PCB Copper Area (SMD Test Point); Mounted: No; ComponentHeight: 0mm; Family: Test Point; Part Number: SMD_PAD_1.27X1.27MM; Pin Count: 1; Sense: No; SMD: Yes; Socket: No; Status: None; Component Kind: Standard (No BOM); Component Type: Standard (No BOM); HelpURL: Undefined; Author: CERN DEM JLC; CreateDate: 12.01.2008; LatestRevisionDate: 12.01.2008; PackageDescription: 1.27mm x 1.27mm PCB Copper Area (SMD Test Point)